# EAGLE design SwitchRouter2x3c (EAGLE 9.0.1)
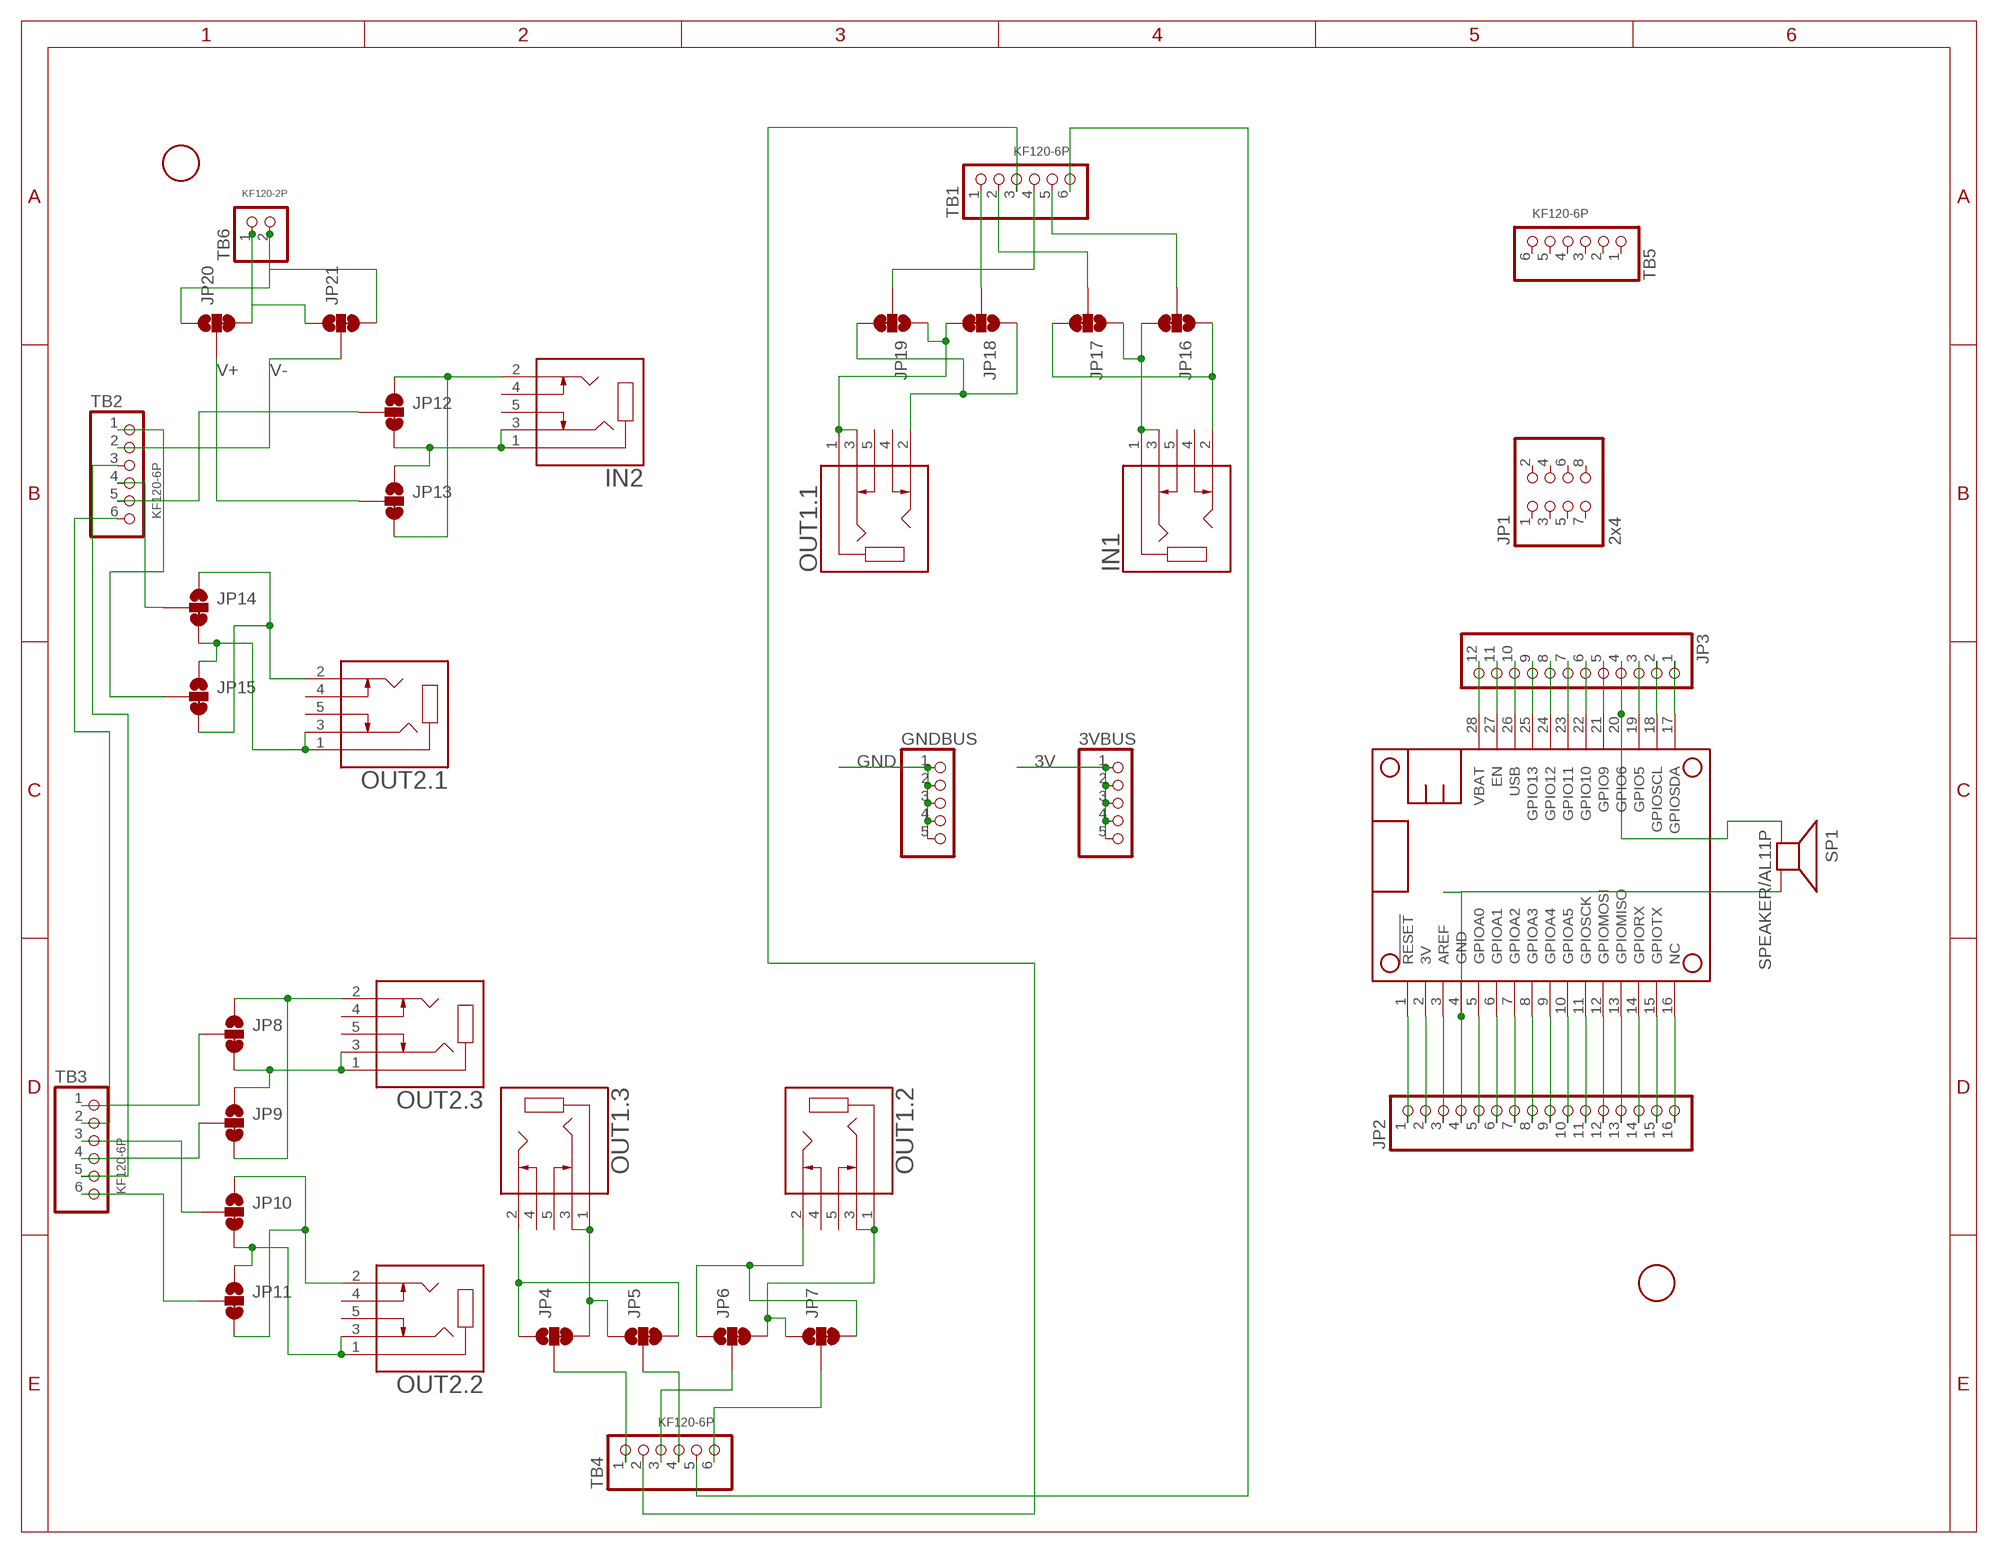
[diagram p0: schematic, sheet 1]

## Parts
3VBUS  PINHD-1X55X2MM  [1_05X2MM]
GNDBUS  PINHD-1X55X2MM  [1_05X2MM]
IN1  SJ1-3535NG-PI  [CUI_SJ1-3535NG-PI]
IN2  SJ1-3535NG-PI  [CUI_SJ1-3535NG-PI]
JP1  2x4  PINHD-2X4  [2X04]
JP2  PINHD-1X16  [1X16]
JP3  PINHD-1X12  [1X12]
JP4  JUMPER-SMT_3_1-NC_TRACE_SILK  [SMT-JUMPER_3_1-NC_TRACE_SILK]
JP5  JUMPER-SMT_3_1-NC_TRACE_SILK  [SMT-JUMPER_3_1-NC_TRACE_SILK]
JP6  JUMPER-SMT_3_1-NC_TRACE_SILK  [SMT-JUMPER_3_1-NC_TRACE_SILK]
JP7  JUMPER-SMT_3_1-NC_TRACE_SILK  [SMT-JUMPER_3_1-NC_TRACE_SILK]
JP8  JUMPER-SMT_3_1-NC_TRACE_SILK  [SMT-JUMPER_3_1-NC_TRACE_SILK]
JP9  JUMPER-SMT_3_1-NC_TRACE_SILK  [SMT-JUMPER_3_1-NC_TRACE_SILK]
JP10  JUMPER-SMT_3_1-NC_TRACE_SILK  [SMT-JUMPER_3_1-NC_TRACE_SILK]
JP11  JUMPER-SMT_3_1-NC_TRACE_SILK  [SMT-JUMPER_3_1-NC_TRACE_SILK]
JP12  JUMPER-SMT_3_1-NC_TRACE_SILK  [SMT-JUMPER_3_1-NC_TRACE_SILK]
JP13  JUMPER-SMT_3_1-NC_TRACE_SILK  [SMT-JUMPER_3_1-NC_TRACE_SILK]
JP14  JUMPER-SMT_3_1-NC_TRACE_SILK  [SMT-JUMPER_3_1-NC_TRACE_SILK]
JP15  JUMPER-SMT_3_1-NC_TRACE_SILK  [SMT-JUMPER_3_1-NC_TRACE_SILK]
JP16  JUMPER-SMT_3_1-NC_TRACE_SILK  [SMT-JUMPER_3_1-NC_TRACE_SILK]
JP17  JUMPER-SMT_3_1-NC_TRACE_SILK  [SMT-JUMPER_3_1-NC_TRACE_SILK]
JP18  JUMPER-SMT_3_1-NC_TRACE_SILK  [SMT-JUMPER_3_1-NC_TRACE_SILK]
JP19  JUMPER-SMT_3_1-NC_TRACE_SILK  [SMT-JUMPER_3_1-NC_TRACE_SILK]
JP20  JUMPER-SMT_3_1-NC_TRACE_SILK  [SMT-JUMPER_3_1-NC_TRACE_SILK]
JP21  JUMPER-SMT_3_1-NC_TRACE_SILK  [SMT-JUMPER_3_1-NC_TRACE_SILK]
MS1  FEATHERWING_NODIM  [FEATHERWING_DIM]
OUT1.1  SJ1-3535NG-PI  [CUI_SJ1-3535NG-PI]
OUT1.2  SJ1-3535NG-PI  [CUI_SJ1-3535NG-PI]
OUT1.3  SJ1-3535NG-PI  [CUI_SJ1-3535NG-PI]
OUT2.1  SJ1-3535NG-PI  [CUI_SJ1-3535NG-PI]
OUT2.2  SJ1-3535NG-PI  [CUI_SJ1-3535NG-PI]
OUT2.3  SJ1-3535NG-PI  [CUI_SJ1-3535NG-PI]
SP1  SPEAKER/AL11P  [AL11P]
TB1  KF120-6P  [KF120-6P_ROUND]
TB2  KF120-6P  [KF120-6P_ROUND]
TB3  KF120-6P  [KF120-6P_ROUND]
TB4  KF120-6P  [KF120-6P_ROUND]
TB5  KF120-6P  [KF120-6P_ROUND]
TB6  KF120-2P  [KF120-2P_ROUND]
U$2  FIDUCIAL  [FIDUCIAL_1MM]
U$3  FIDUCIAL  [FIDUCIAL_1MM]

## Nets
3V: 3VBUS.1 3VBUS.2 3VBUS.3 3VBUS.4 3VBUS.5 JP2.2 MS1.2(3V)
GND: GNDBUS.1 GNDBUS.2 GNDBUS.3 GNDBUS.4 GNDBUS.5 JP2.4 MS1.4(GND) SP1.-
N$1: JP2.3 MS1.3(AREF)
N$3: JP2.5 MS1.5(GPIOA0)
N$4: JP2.6 MS1.6(GPIOA1)
N$5: JP2.7 MS1.7(GPIOA2)
N$6: JP2.8 MS1.8(GPIOA3)
N$7: JP2.9 MS1.9(GPIOA4)
N$8: JP2.10 MS1.10(GPIOA5)
N$9: JP2.11 MS1.11(GPIOSCK)
N$10: JP2.12 MS1.12(GPIOMOSI)
N$11: JP2.13 MS1.13(GPIOMISO)
N$12: JP2.14 MS1.14(GPIORX)
N$13: JP2.15 MS1.15(GPIOTX)
N$14: JP2.16 MS1.16(NC)
N$15: JP3.3 MS1.19(GPIO5)
N$16: JP4.1 JP5.3 OUT1.3.2
N$17: JP4.3 JP5.1 OUT1.3.1 OUT1.3.3
N$18: JP2.1 MS1.1(!RESET)
N$19: JP3.4 MS1.20(GPIO6) SP1.+
N$20: JP3.5 MS1.21(GPIO9)
N$21: JP3.6 MS1.22(GPIO10)
N$22: JP3.7 MS1.23(GPIO11)
N$23: JP3.8 MS1.24(GPIO12)
N$24: JP4.2 TB4.1
N$25: JP6.1 JP7.3 OUT1.2.2
N$26: JP6.3 JP7.1 OUT1.2.1 OUT1.2.3
N$27: JP5.2 TB4.4
N$28: JP6.2 TB4.3
N$29: JP7.2 TB4.6
N$30: JP8.1 JP9.3 OUT2.3.2
N$31: JP8.3 JP9.1 OUT2.3.1 OUT2.3.3
N$32: JP8.2 TB3.1
N$33: JP9.2 TB3.4
N$34: JP10.2 TB3.3
N$35: JP11.2 TB3.6
N$36: JP10.1 JP11.3 OUT2.2.2
N$37: JP10.3 JP11.1 OUT2.2.1 OUT2.2.3
N$38: IN2.2 JP12.1 JP13.3
N$39: IN2.1 IN2.3 JP12.3 JP13.1
N$41: JP20.3 JP21.1 TB6.1
N$42: JP20.1 JP21.3 TB6.2
N$43: JP15.2 TB2.1
N$44: JP3.1 MS1.17(GPIOSDA)
N$45: JP14.1 JP15.3 OUT2.1.2
N$46: JP14.3 JP15.1 OUT2.1.1 OUT2.1.3
N$47: JP14.2 TB2.4
N$48: TB2.3 TB3.5
N$49: TB2.6 TB3.2
N$50: IN1.2 JP16.1 JP17.3
N$51: JP3.9 MS1.25(GPIO13)
N$52: IN1.1 IN1.3 JP16.3 JP17.1
N$53: JP18.1 JP19.3 OUT1.1.2
N$54: JP18.3 JP19.1 OUT1.1.1 OUT1.1.3
N$55: JP17.2 TB1.2
N$56: TB1.6 TB4.5
N$57: JP19.2 TB1.4
N$58: JP18.2 TB1.1
N$59: TB1.3 TB4.2
N$60: JP16.2 TB1.5
N$61: JP3.11 MS1.27(EN)
N$62: JP12.2 TB2.5
SCL: JP3.2 MS1.18(GPIOSCL)
USB: JP3.10 MS1.26(USB)
V+: JP13.2 JP20.2
V-: JP21.2 TB2.2
VBAT: JP3.12 MS1.28(VBAT)
Unconnected: IN1.4 IN1.5 IN2.4 IN2.5 JP1.1 JP1.2 JP1.3 JP1.4 JP1.5 JP1.6 JP1.7 JP1.8 OUT1.1.4 OUT1.1.5 OUT1.2.4 OUT1.2.5 OUT1.3.4 OUT1.3.5 OUT2.1.4 OUT2.1.5 OUT2.2.4 OUT2.2.5 OUT2.3.4 OUT2.3.5 TB5.1 TB5.2 TB5.3 TB5.4 TB5.5 TB5.6

## Library data of the parts
3VBUS GNDBUS = pinhead:PINHD-1X5: PIN HEADER
IN1 IN2 OUT1.1-OUT1.3 OUT2.1-OUT2.3 = SJ1-3535NG-PI:SJ1-3535NG-PI: 3.5 mm Right-Angle Stereo Jack, 5 pin PCB PCB Mount, Isolated Ground, Pink; MANUFACTURER: CUI; PARTREV: 1.02; STANDARD: Manufacturer recommendation
JP1 = pinhead:PINHD-2X4: PIN HEADER
JP2 = pinhead:PINHD-1X16: PIN HEADER
JP3 = pinhead:PINHD-1X12: PIN HEADER
JP4-JP21 = SparkFun-Jumpers:JUMPER-SMT_3_1-NC_TRACE: Normally closed trace jumper (1 of 2 connections) This jumper has a trace between two pads so it's normally closed (NC). The other connection is normally open (NO). Use a razor knife to open the connection. For best results follow the IPC guidelines for cutting traces: Cutout at least 0.063 mm (0.005 in). Remove all loose material to clean up the cut area. Seal the cut with an approved epoxy. Reapply solder to reclose the connection, or to close the NO connection.
MS1 = microbuilder:FEATHERWING
SP1 = adafruit:SPEAKER: SPEAKER Source: Buerklin Added PS12 (for part # PS1240 piezo) http://www.ladyada.net/library/pcb/eaglelibrary.html
TB1-TB5 = home:KF120-6P: Kaweei KF120-6P 6-pin screw terminalblock, 0.1" spacing. Adafruit
TB6 = home:KF120-2P: Kaweei KF120-2P 2-pin screw terminal block, 0.1" spacing. Through-hole. Adafruit
U$2 U$3 = adafruit:FIDUCIAL: For use by pick and place machines to calibrate the vision/machine, 1mm By microbuilder.eu

## Net classes
0 default: width 0.203 mm, clearance 0.203 mm
1 2A: width 0.406 mm, clearance 0.203 mm
2 coils 200mA: width 0.203 mm, clearance 0.203 mm

## Board
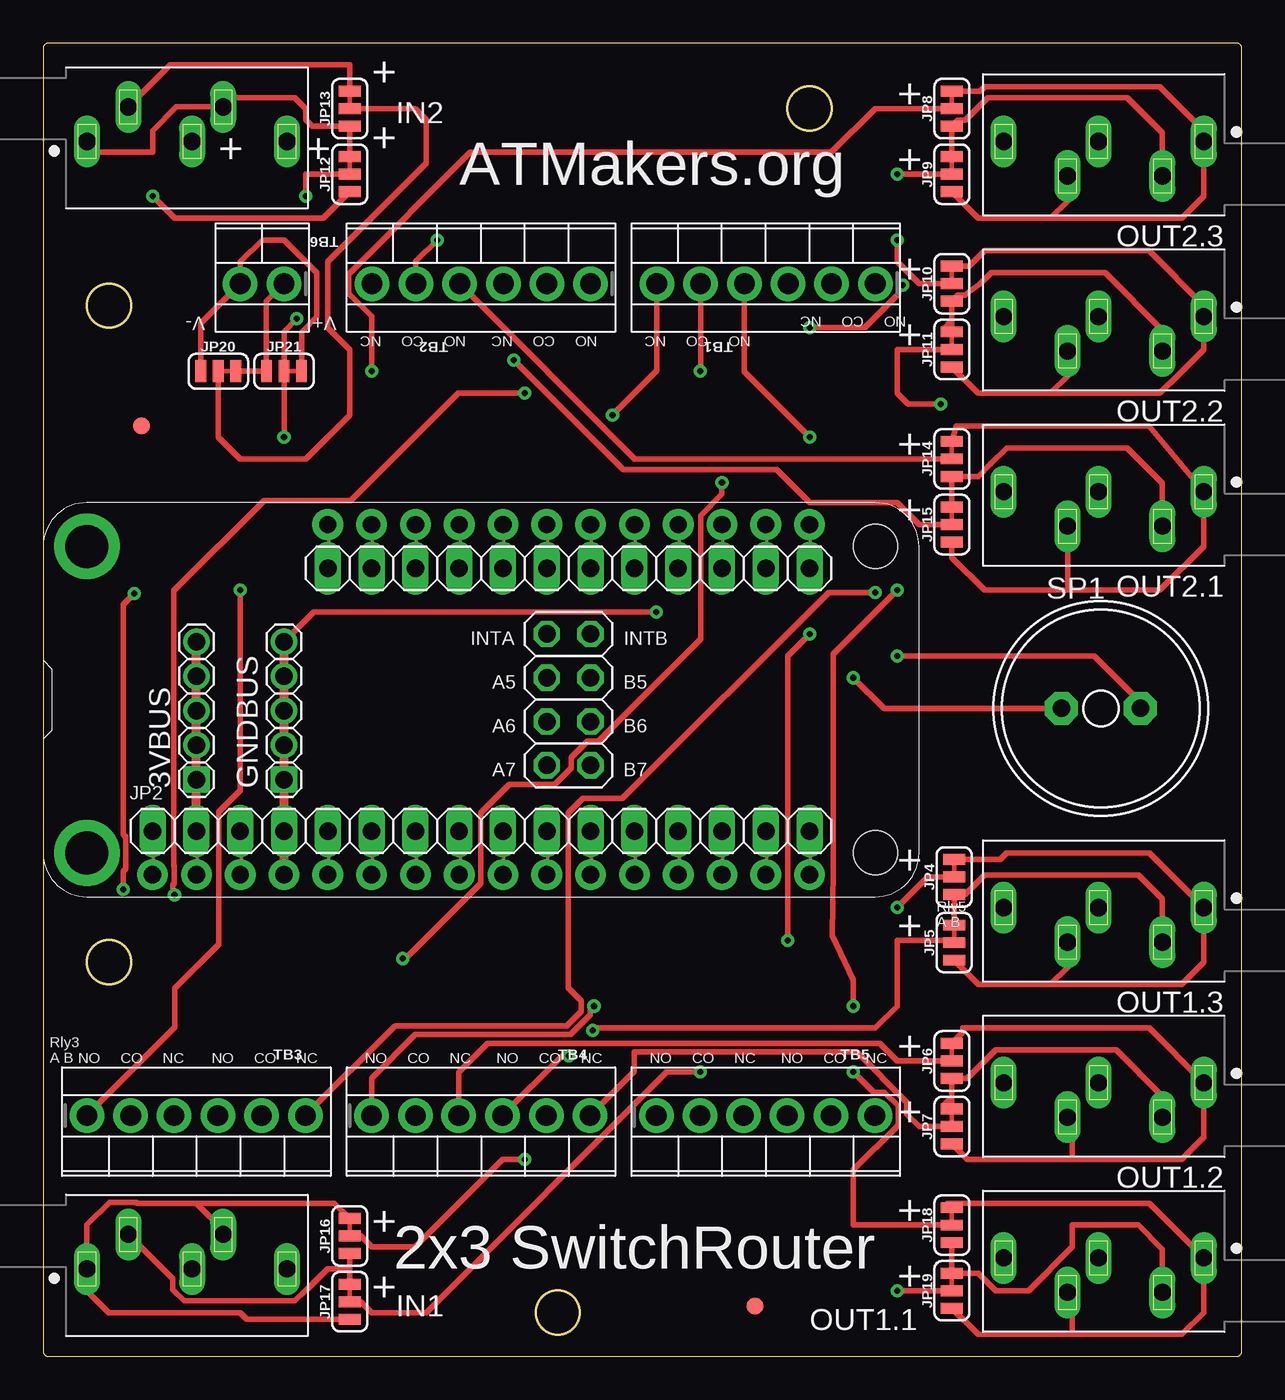
[diagram p1: board, top side]
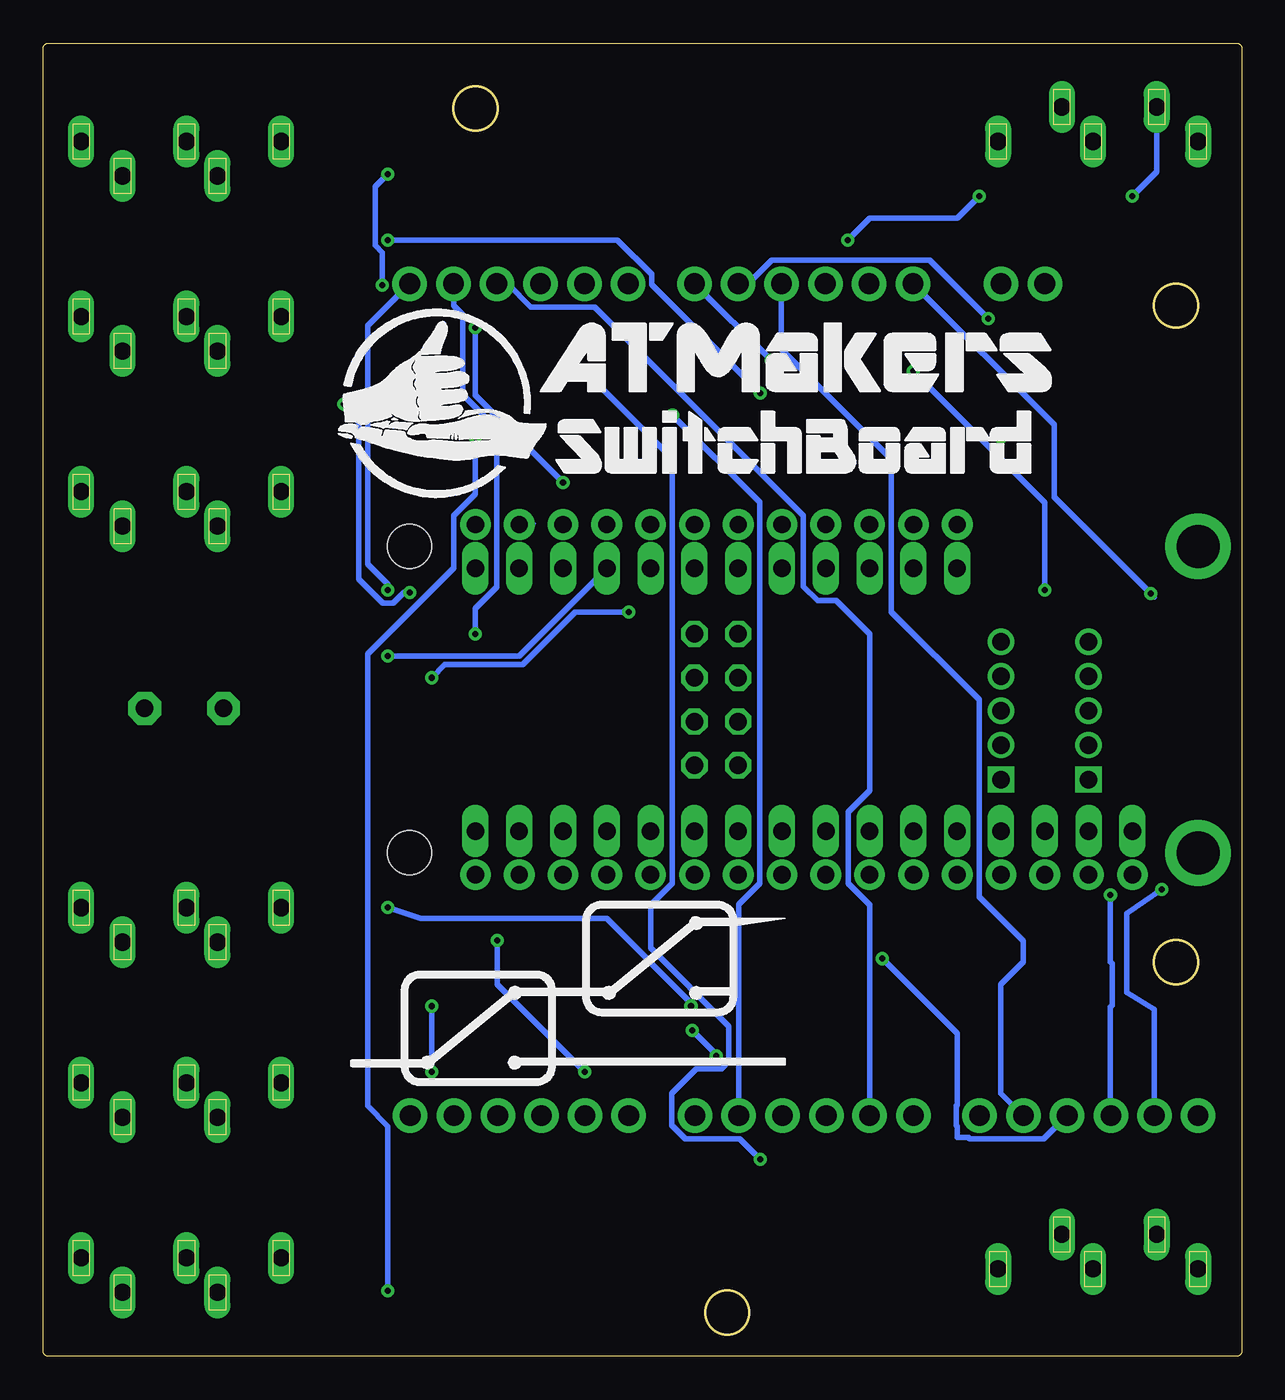
[diagram p2: board, bottom side, seen from below]

Size 69.52 x 76.19 mm. Coordinates in mm from the lower left corner, seen from the top.
Outline: 69.52,0.32 69.52,75.87 arc90 69.2,76.19 0.32,76.19 arc90 0,75.87 0,0.32 arc90 0.32,0 69.2,0 arc90 69.52,0.32
Outline: circle at 3.81,60.96 radius 1.27
Outline: circle at 44.45,72.39 radius 1.27
Outline: circle at 3.81,22.86 radius 1.27
Outline: circle at 29.84,2.54 radius 1.27
Copper layers (1*16): Top 0.035mm / dielectric 1.5mm / Bottom 0.035mm
Design rules "default *": minimum track width 6mil, minimum drill 0.35mm, track to track 6mil, track to pad 6mil, pad to pad 6mil, via to via 6mil, smd to smd 6mil, copper to edge 40mil, drill to drill 6mil, minimum pad ring 10mil, minimum via ring 8mil, stop-mask expansion 4mil, vias tented up to drill 14mil, thermal gap 10mil
bRestrict: area 6.7,55.2 to 7.2,56.5; area 2.9,55.2 to 3.4,56.5
vRestrict: area 4.6,64.8 to 8,66; area 1.3,55.2 to 3.8,56.5; area 5.1,55.2 to 7.6,56.5; area 5.8,58.3 to 7,59.3; area 2,58.4 to 3.3,59.3

### Footprints (pad centres in the part's own frame; a part is rotated, then mirrored left to right if it is on the bottom)
1_05X2MM = drill 1.016 pad 1.3 square: 1 -4,0 | drill 1.016 pad 1.3: 2 -2,0; 3 0,0; 4 2,0; 5 4,0
CUI_SJ1-3535NG-PI = drill 1 long: 1 0,0; 2 2.4,2; 3 7.9,2; 4 11.6,0; 5 6.1,0
2X04 = drill 1.016 octagon: 1 -3.81,-1.27; 2 -3.81,1.27; 3 -1.27,-1.27; 4 -1.27,1.27; 5 1.27,-1.27; 6 1.27,1.27; 7 3.81,-1.27; 8 3.81,1.27
1X16 = drill 1.016 long: 1 -19.05,0; 2 -16.51,0; 3 -13.97,0; 4 -11.43,0; 5 -8.89,0; 6 -6.35,0; 7 -3.81,0; 8 -1.27,0; 9 1.27,0; 10 3.81,0; 11 6.35,0; 12 8.89,0; 13 11.43,0; 14 13.97,0; 15 16.51,0; 16 19.05,0
1X12 = drill 1.016 long: 1 -13.97,0; 2 -11.43,0; 3 -8.89,0; 4 -6.35,0; 5 -3.81,0; 6 -1.27,0; 7 1.27,0; 8 3.81,0; 9 6.35,0; 10 8.89,0; 11 11.43,0; 12 13.97,0
SMT-JUMPER_3_1-NC_TRACE_SILK = smd 0.635 x 1.27: 1 -1.016,0; 2 0,0; 3 1.016,0
FEATHERWING_DIM = drill 1 pad 1.778: 1 6.35,1.27; 2 8.89,1.27; 3 11.43,1.27; 4 13.97,1.27; 5 16.51,1.27; 6 19.05,1.27; 7 21.59,1.27; 8 24.13,1.27; 9 26.67,1.27; 10 29.21,1.27; 11 31.75,1.27; 12 34.29,1.27; 13 36.83,1.27; 14 39.37,1.27; 15 41.91,1.27; 16 44.45,1.27; 17 44.45,21.59; 18 41.91,21.59; 19 39.37,21.59; 20 36.83,21.59; 21 34.29,21.59; 22 31.75,21.59; 23 29.21,21.59; 24 26.67,21.59; 25 24.13,21.59; 26 21.59,21.59; 27 19.05,21.59; 28 16.51,21.59 | drill 2.5 pad 3.81: P$1 2.54,20.32; P$2 2.54,2.54 | hole 2.54: 48.26,20.32; 48.26,2.54
AL11P = drill 1.016 pad 1.905 octagon: + 2.286,0; - -2.286,0
KF120-6P_ROUND = drill 1.2 pad 2: 1 -6.35,0; 2 -3.81,0; 3 -1.3,0; 4 1.24,0; 5 3.78,0; 6 6.32,0
KF120-2P_ROUND = drill 1.2 pad 2: 1 -1.27,0; 2 1.27,0
FIDUCIAL_1MM = smd 1 x 1: 1 0,0

### Placement (x,y rotation side)
3VBUS  8.89,37.47 90 top
GNDBUS  13.97,37.47 90 top
IN1  2.54,5.08 0 top
IN2  2.54,70.48 0 top
JP1  30.48,38.1 270 top
JP2  25.4,30.48 0 top
JP3  30.48,45.72 180 top
JP4  52.83,27.81 90 top
JP5  52.83,24 90 top
JP6  52.7,17.14 90 top
JP7  52.7,13.34 90 top
JP8  52.7,72.39 90 top
JP9  52.7,68.58 90 top
JP10  52.7,62.23 90 top
JP11  52.7,58.42 90 top
JP12  17.78,68.58 90 top
JP13  17.78,72.39 90 top
JP14  52.7,52.07 90 top
JP15  52.7,48.26 90 top
JP16  17.78,6.99 90 top
JP17  17.78,3.17 90 top
JP18  52.7,7.62 90 top
JP19  52.7,3.81 90 top
JP20  10.16,57.15 0 top
JP21  13.97,57.15 0 top
MS1  0,26.67 0 top
OUT1.1  67.31,5.71 180 top
OUT1.2  67.31,15.88 180 top
OUT1.3  67.31,26.04 180 top
OUT2.1  67.31,50.16 180 top
OUT2.2  67.31,60.33 180 top
OUT2.3  67.31,70.48 180 top
SP1  61.34,37.59 0 top
TB1  41.91,62.23 180 top
TB2  25.4,62.23 180 top
TB3  8.89,13.97 0 top
TB4  25.4,13.97 0 top
TB5  41.91,13.97 0 top
TB6  12.7,62.23 180 top
U$2  5.71,53.98 0 top
U$3  41.27,2.92 0 top

### Tracks (layer width: path | path; a pad name or v marks a point on that pad's centre or on a via)
3V
  Top 0.203: JP2.2 8.94,30.43 8.94,27.99 MS1.2
  Top 0.508: JP2.2 3VBUS.1 3VBUS.2 3VBUS.3 3VBUS.4 3VBUS.5
GND  (via drill 0.35)
  Top 0.305: SP1.- 48.77,37.59 v46.99,39.37 | v35.56,43.18 15.69,43.18 GNDBUS.5
  Top 0.508: MS1.4 JP2.4 GNDBUS.1 GNDBUS.2 GNDBUS.3 GNDBUS.4 GNDBUS.5
  Bottom 0.305: v46.99,39.37 46.23,40.13 41.7,40.13 38.65,43.18 v35.56,43.18
N$1
  Top 0.203: JP2.3 11.48,30.43 11.48,27.99 MS1.3
N$3
  Top 0.203: JP2.5 16.56,30.43 16.56,27.99 MS1.5
N$4
  Top 0.203: JP2.6 19.1,30.43 19.1,27.99 MS1.6
N$5
  Top 0.203: JP2.7 21.64,30.43 21.64,27.99 MS1.7
N$6
  Top 0.203: JP2.8 24.18,30.43 24.18,27.99 MS1.8
N$7
  Top 0.203: JP2.9 26.72,30.43 26.72,27.99 MS1.9
N$8
  Top 0.203: JP2.10 29.26,30.43 29.26,27.99 MS1.10
N$9
  Top 0.203: JP2.11 31.8,30.43 31.8,27.99 MS1.11
N$10
  Top 0.203: JP2.12 34.34,30.43 34.34,27.99 MS1.12
N$11
  Top 0.203: JP2.13 36.88,30.43 36.88,27.99 MS1.13
N$12
  Top 0.203: JP2.14 39.42,30.43 39.42,27.99 MS1.14
N$13
  Top 0.203: JP2.15 41.96,30.43 41.96,27.99 MS1.15
N$14
  Top 0.203: JP2.16 44.5,30.43 44.5,27.99 MS1.16
N$15
  Top 0.203: JP3.3 39.42,45.77 39.42,48.21 MS1.19
N$16
  Top 0.305: JP5.3 JP4.1 53.47,26.8 54.61,27.94 63.5,27.94 64.91,26.53 OUT1.3.2
N$17
  Top 0.305: JP5.1 54.23,21.59 58.42,21.59 | 58.42,21.59 66.04,21.59 67.31,22.86 OUT1.3.1 64.14,29.21 55.88,29.21 55.5,28.83 JP4.3 | OUT1.3.3 59.41,22.58 58.42,21.59
N$18
  Top 0.203: MS1.1 6.4,27.99 6.4,30.43 JP2.1
N$19  (via drill 0.35)
  Top 0.203: JP3.4 36.88,45.77 36.88,48.21 MS1.20
  Top 0.305: v49.53,40.64 60.96,40.64 63.63,37.97 SP1.+
  Bottom 0.305: JP3.4 41.91,40.64 v49.53,40.64
N$20
  Top 0.203: JP3.5 34.34,45.77 34.34,48.21 MS1.21
N$21
  Top 0.203: JP3.6 31.8,45.77 31.8,48.21 MS1.22
N$22
  Top 0.203: JP3.7 29.26,45.77 29.26,48.21 MS1.23
N$23
  Top 0.203: JP3.8 26.72,45.77 26.72,48.21 MS1.24
N$24  (via drill 0.35)
  Top 0.305: JP4.2 51.31,27.81 v49.53,26.04 | v31.95,20.32 31.72,20.09 31.72,19.81 30.59,18.67 21.59,18.67 19.05,16.13 TB4.1
  Bottom 0.305: v49.53,26.04 47.62,25.4 36.83,25.4 31.95,20.52 v31.95,20.32
N$25
  Top 0.305: 52.22,14.35 52.22,14.55 52.7,15.03 | 52.7,15.03 JP6.1 53.59,16.13 55.24,17.78 62.23,17.78 64.91,15.1 OUT1.2.2 | JP7.3 52.7,15.03
N$26
  Top 0.305: JP7.1 53.59,11.43 59.69,11.43 | 59.69,11.43 66.04,11.43 67.31,12.7 OUT1.2.1 64.14,19.05 53.34,19.05 53.34,18.8 JP6.3 | OUT1.2.3 59.69,13.6 59.69,11.43
N$27  (via drill 0.35)
  Top 0.305: JP5.2 52.7,24.13 49.53,24.13 49.53,20.32 48.26,19.05 32,19.05 v31.88,18.92 | v30.48,17.43 30.1,17.43 TB4.4
  Bottom 0.305: v31.88,18.92 30.48,17.53 v30.48,17.43
N$28
  Top 0.305: TB4.3 24.1,16.48 25.78,18.16 48.51,18.16 49.53,17.14 JP6.2
N$29
  Top 0.305: TB4.6 34.29,16.54 34.29,17.65 47.18,17.65 50.09,14.74 50.09,14.04 50.8,13.34 JP7.2
N$30
  Top 0.305: JP9.3 JP8.1 53.05,71.72 53.49,71.72 54.8,73.03 62.87,73.03 64.91,70.98 OUT2.3.2
N$31
  Top 0.305: JP9.1 54.23,66.04 58.42,66.04 | 58.42,66.04 66.04,66.04 67.31,67.31 OUT2.3.1 67.31,71.12 64.77,73.66 54.61,73.66 54.36,73.41 JP8.3 | OUT2.3.3 59.41,67.03 58.42,66.04
N$32  (via drill 0.35)
  Top 0.305: TB3.1 7.64,19.07 7.64,21.36 10.19,23.9 10.19,31.58 11.43,32.82 v11.43,44.45 | v19.05,57.15 19.05,60.34 17.72,61.67 17.72,62.79 24.78,69.85 45.72,69.85 48.26,72.39 JP8.2
  Bottom 0.305: v11.43,44.45 11.43,49.53 v19.05,57.15
N$33  (via drill 0.35)
  Top 0.305: v39.37,50.7 39.37,50.02 38.12,48.78 38.12,41.62 32.21,35.71 31.59,35.71 30.63,34.75 30.63,34.13 29.67,33.17 27.02,33.17 25.38,31.53 25.38,27.42 21.2,23.25 21.03,23.08 v20.86,23.08 | v49.84,62.15 49.62,61.92 49.62,61.67 47.64,59.69 v44.45,59.69 | JP9.2 v49.53,68.58
  Bottom 0.305: v39.37,50.7 44.45,55.78 v44.45,59.69 | v49.84,62.15 49.84,64.04 50.26,64.47 50.26,67.85 v49.53,68.58 | TB3.4 11.49,12.61 15.77,12.61 15.86,12.7 16.51,12.7 16.51,13.35 16.57,13.41 16.57,14.53 16.51,14.59 16.51,18.73 v20.86,23.08
N$34  (via drill 0.35)
  Top 0.305: v27.94,55.88 24.06,55.88 17.84,49.66 12.83,49.66 7.59,44.42 7.59,28.46 7.59,27.42 7.53,27.36 7.53,26.86 v7.62,26.77 | v49.53,64.77 49.53,63.5 50.8,62.23 JP10.2
  Bottom 0.305: v27.94,55.88 34.23,62.17 34.23,62.79 36.21,64.77 v49.53,64.77 | TB3.3 7.62,14 7.62,20.29 7.53,20.38 7.53,22.8 7.62,22.89 v7.62,26.77
N$35  (via drill 0.35)
  Top 0.305: v48.26,44.33 45.57,44.33 33.6,32.36 31.29,32.36 30.45,31.53 30.45,21.38 31.21,20.62 31.21,20.02 30.38,19.18 20.42,19.18 TB3.6 | v52.07,55.24 50.16,55.24 49.53,55.88 49.53,58.42 JP11.2
  Bottom 0.305: v48.26,44.33 48.62,44.33 49.23,43.72 49.83,43.72 51.21,45.09 51.21,54.61 51.84,55.24 v52.07,55.24
N$36
  Top 0.305: 52.22,59.44 52.22,59.64 52.7,60.12 | 52.7,60.12 JP10.1 53.05,61.56 53.49,61.56 53.7,61.77 54.33,62.2 54.99,62.87 61.59,62.87 64.91,59.55 OUT2.2.2 | JP11.3 52.7,60.12
N$37
  Top 0.305: JP11.1 54.23,55.88 58.42,55.88 | 58.42,55.88 64.77,55.88 65.35,56.46 65.37,56.46 67.31,58.4 OUT2.2.1 67.31,60.96 64.14,64.14 54.61,64.14 53.72,63.25 JP10.3 | OUT2.2.3 59.41,56.87 58.42,55.88
N$38  (via drill 0.35)
  Top 0.305: JP13.3 17.78,74.93 7.38,74.93 IN2.2 | JP12.1 16.26,66.04 7.62,66.04 v6.35,67.31
  Bottom 0.305: v6.35,67.31 4.94,68.72 IN2.2
N$39
  Top 0.305: IN2.1 3.17,69.85 6.35,69.85 6.35,71.12 7.71,72.48 IN2.3 10.98,73.03 14.61,73.03 15.24,72.39 15.24,71.75 15.62,71.37 JP13.1 JP12.3
N$41
  Top 0.305: TB6.1 12.95,61.21 JP21.1 JP20.3
N$42
  Top 0.305: JP20.1 9.14,59.94 TB6.2 11.43,63.5 12.7,64.77 13.97,64.77 15.88,62.87 15.88,60.33 14.99,59.44 JP21.3
N$43  (via drill 0.35)
  Top 0.305: v27.3,57.78 33.66,51.44 42.55,51.44 44.45,49.53 49.53,49.53 50.8,48.26 JP15.2
  Bottom 0.305: v27.3,57.78 TB2.1
N$44
  Top 0.203: MS1.17 44.5,48.21 44.5,45.77 JP3.1
N$45
  Top 0.305: JP15.3 JP14.1 54.23,51.05 54.93,51.75 54.97,51.79 55.88,52.7 62.87,52.7 64.91,50.66 OUT2.1.2
N$46
  Top 0.305: 59.69,44.45 64.77,44.45 67.31,46.99 OUT2.1.1 64.14,53.98 52.96,53.98 JP14.3 | 59.69,44.45 54.61,44.45 52.7,46.35 JP15.1 | OUT2.1.3 59.41,44.73 59.69,44.45
N$47
  Top 0.305: TB2.4 34.32,52.07 52.07,52.07 52.22,52.07 JP14.2
N$48
  Bottom 0.305: TB2.3 26.7,58.45 20.32,52.07 20.32,43.18 15.24,38.1 15.24,26.67 12.67,24.1 12.67,22.89 13.97,21.59 13.97,15.27 TB3.5
N$49  (via drill 0.35)
  Top 0.305: v5.28,44.25 4.66,43.62 4.66,30.29 4.8,30.15 4.8,28.27 4.66,28.13 v4.66,27.09
  Bottom 0.305: 5.08,44.05 v5.28,44.25 10.89,49.86 10.89,54.04 TB2.6 | TB3.2 5.08,20.14 6.68,21.11 6.68,25.7 v4.66,27.09
N$50
  Top 0.305: JP17.3 17.78,5.08 | 17.78,5.08 JP16.1 | IN1.2 7.53,4.49 7.53,3.87 8.18,3.22 14.6,3.22 15.19,3.81 15.24,3.81 16.51,5.08 17.78,5.08
N$51
  Top 0.203: JP3.9 24.18,45.77 24.18,48.21 MS1.25
N$52
  Top 0.305: 8.89,8.89 5.45,8.89 5.4,8.94 3.86,8.94 2.54,7.62 IN1.1 2.54,3.81 3.81,2.54 11.43,2.54 11.81,2.16 JP17.1 | 8.89,8.89 10.44,7.34 IN1.3 | JP16.3 16.89,8.89 8.89,8.89
N$53
  Top 0.305: JP18.1 JP19.3 54.23,4.83 55.24,3.81 57.15,3.81 59.69,6.35 59.69,7.62 63.5,7.62 64.91,6.21 OUT1.1.2
N$54
  Top 0.305: JP19.1 54.23,1.27 59.69,1.27 | 59.69,1.27 66.04,1.27 67.31,2.54 OUT1.1.1 64.14,8.89 52.96,8.89 | 52.22,8.64 52.48,8.89 52.96,8.89 | JP18.3 52.96,8.89 | OUT1.1.3 59.69,3.44 59.69,1.27
N$55  (via drill 0.35)
  Top 0.305: v38.1,16.51 36.18,16.51 22.21,2.54 19.05,2.54 18.41,3.17 JP17.2 | v43.18,24.13 43.18,40.64 v44.45,41.91
  Bottom 0.305: v38.1,16.51 43.18,21.59 v43.18,24.13 | v44.45,41.91 44.45,43.38 43.2,44.62 43.2,53.82 45.18,55.8 45.18,60.42 45.72,60.96 TB1.2
N$56  (via drill 0.35)
  Top 0.305: TB1.6 35.59,57.18 v33.02,54.61
  Bottom 0.305: TB4.5 29.18,26.21 27.96,27.42 27.96,49.55 v33.02,54.61
N$57  (via drill 0.35)
  Top 0.305: TB1.4 40.67,57.12 v44.45,53.34 | JP19.2 v49.53,3.81
  Bottom 0.305: v49.53,3.81 49.53,12.7 49.53,13.35 50.7,14.52 50.7,40.74 45.7,45.74 45.7,48.78 44.45,50.02 v44.45,53.34
N$58  (via drill 0.35)
  Top 0.305: JP18.2 46.99,7.62 46.99,10.81 49.59,13.41 49.59,14.53 48.79,15.33 48.17,15.33 v46.99,16.51 | v49.53,44.45 45.82,40.74 45.82,28.2 45.78,24.44 46.99,21.84 v46.99,20.32
  Bottom 0.305: v49.53,44.45 49.53,44.81 50.7,45.98 50.7,59.79 TB1.1 | v46.99,16.51 v46.99,20.32
N$59
  Bottom 0.305: TB4.2 21.59,26.18 22.84,27.42 22.84,31.58 21.59,32.82 21.59,41.91 23.52,43.84 24.59,43.84 25.43,44.67 25.43,48.78 37.52,60.87 41.23,60.87 42.59,62.23 TB1.3
N$60  (via drill 0.35)
  Top 0.305: v27.94,11.43 26.67,11.43 21.59,6.35 19.05,6.35 18.41,6.99 JP16.2 | v38.1,57.15 38.13,57.18 TB1.5
  Bottom 0.305: v27.94,11.43 29.12,12.61 32.28,12.61 33.08,13.41 33.08,15.26 31.64,16.69 30.18,16.69 29.75,17.12 29.75,19.16 34.29,23.7 34.29,26.18 33.05,27.42 33.05,52.09 v38.1,57.15
N$61
  Top 0.203: JP3.11 19.1,45.77 19.1,48.21 MS1.27
N$62  (via drill 0.35)
  Top 0.305: TB2.5 21.62,63.53 v22.86,64.77 | JP12.2 15.24,68.58 v15.24,67.31
  Bottom 0.305: v22.86,64.77 21.59,66.04 16.51,66.04 v15.24,67.31
SCL
  Top 0.203: MS1.18 41.96,48.21 41.96,45.77 JP3.2
  Bottom 0.203: 41.05,48.31 41.86,48.31 MS1.18
USB
  Top 0.203: JP3.10 21.64,45.77 21.64,48.21 MS1.26
V+
  Top 0.305: JP20.2 10.16,53.34 11.43,52.07 15.24,52.07 17.78,54.61 17.78,58.42 16.51,59.69 16.51,63.5 22.23,69.22 22.23,71.75 21.59,72.39 JP13.2
V-  (via drill 0.35)
  Top 0.305: v13.97,53.34 JP21.2 13.97,59.46 v14.72,60.21
  Bottom 0.305: TB2.2 28.62,62.23 27.26,63.59 18.1,63.59 v14.72,60.21
VBAT
  Top 0.203: JP3.12 16.56,45.77 16.56,48.21 MS1.28

### Text on the board
tPlace: V- | V+ | NO CO NC | NO CO NC | NO CO NC | NO CO NC | Rly5 / A B | Rly3 / A B | NO CO NC | NO CO NC | NO CO NC | NO CO NC | NO CO NC | NO CO NC
tNames: + | + | + | + | + | + | ATMakers.org | + | + | + | + | INTA | INTB | A5 | B5 | A6 | B6 | A7 | B7 | + | + | + | + | + | + | 2x3 SwitchRouter | + | +